# Altium schematic sheet relay_driver.SchDoc
size A2
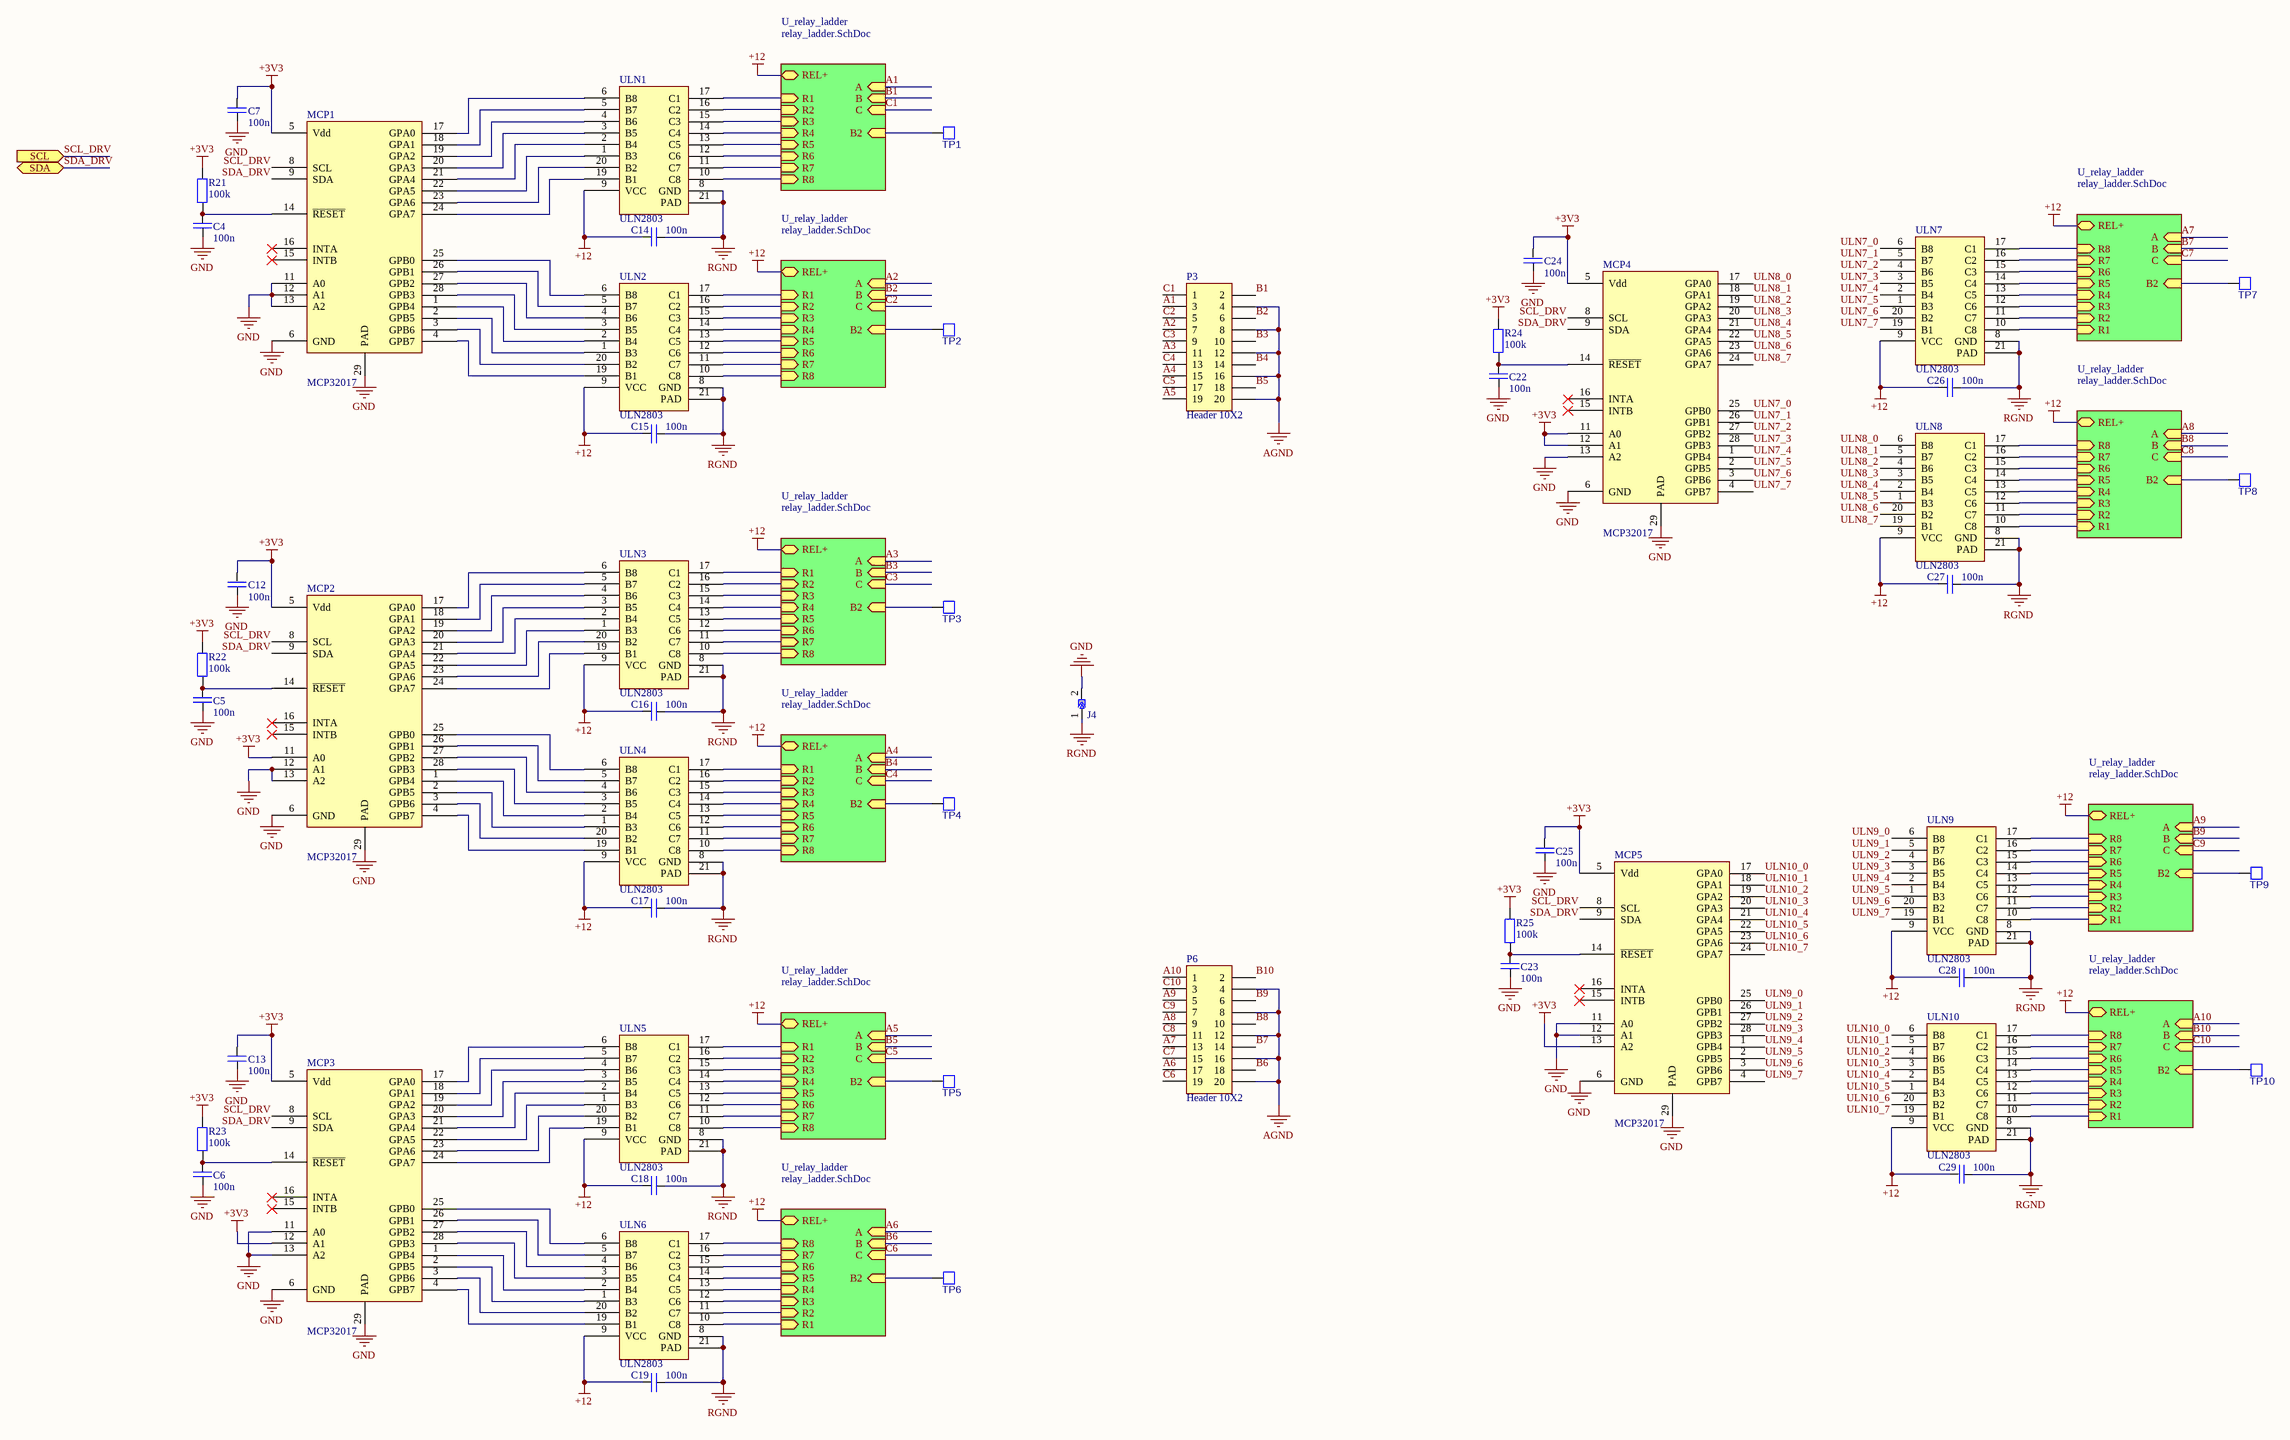
[diagram p0: relay_driver.SchDoc]

## Parts
C4  100n  [R1005_0402i_L]
C5  100n  [R1005_0402i_L]
C6  100n  [R1005_0402i_L]
C7  100n  [R1005_0402i_L]
C12  100n  [R1005_0402i_L]
C13  100n  [R1005_0402i_L]
C14  100n  [R1005_0402i_L]
C15  100n  [R1005_0402i_L]
C16  100n  [R1005_0402i_L]
C17  100n  [R1005_0402i_L]
C18  100n  [R1005_0402i_L]
C19  100n  [R1005_0402i_L]
C22  100n  [R1005_0402i_L]
C23  100n  [R1005_0402i_L]
C24  100n  [R1005_0402i_L]
C25  100n  [R1005_0402i_L]
C26  100n  [R1005_0402i_L]
C27  100n  [R1005_0402i_L]
C28  100n  [R1005_0402i_L]
C29  100n  [R1005_0402i_L]
J4  solder_jumper  [solder_jumper_triangle]  (value not drawn)
MCP1  MCP32017  [MCP23017 QFN]
MCP2  MCP32017  [MCP23017 QFN]
MCP3  MCP32017  [MCP23017 QFN]
MCP4  MCP32017  [MCP23017 QFN]
MCP5  MCP32017  [MCP23017 QFN]
P3  Header 10X2  [HDR2X10]
P6  Header 10X2  [HDR2X10]
R21  100k  [R1005_0402i_L]
R22  100k  [R1005_0402i_L]
R23  100k  [R1005_0402i_L]
R24  100k  [R1005_0402i_L]
R25  100k  [R1005_0402i_L]
TP1  PAD  [PAD_CIRC_HOLE]  (value not drawn)
TP2  PAD  [PAD_CIRC_HOLE]  (value not drawn)
TP3  PAD  [PAD_CIRC_HOLE]  (value not drawn)
TP4  PAD  [PAD_CIRC_HOLE]  (value not drawn)
TP5  PAD  [PAD_CIRC_HOLE]  (value not drawn)
TP6  PAD  [PAD_CIRC_HOLE]  (value not drawn)
TP7  PAD  [PAD_CIRC_HOLE]  (value not drawn)
TP8  PAD  [PAD_CIRC_HOLE]  (value not drawn)
TP9  PAD  [PAD_CIRC_HOLE]  (value not drawn)
TP10  PAD  [PAD_CIRC_HOLE]  (value not drawn)
ULN1  ULN2803  [QFN127P600-8N]
ULN2  ULN2803  [QFN127P600-8N]
ULN3  ULN2803  [QFN127P600-8N]
ULN4  ULN2803  [QFN127P600-8N]
ULN5  ULN2803  [QFN127P600-8N]
ULN6  ULN2803  [QFN127P600-8N]
ULN7  ULN2803  [QFN127P600-8N]
ULN8  ULN2803  [QFN127P600-8N]
ULN9  ULN2803  [QFN127P600-8N]
ULN10  ULN2803  [QFN127P600-8N]

## Sub-sheets
U_relay_ladder = relay_ladder.SchDoc: B (in), C (in), A (in), REL+ (bidir), R1 (in), R2 (in), R3 (in), R4 (in), R5 (in), R6 (in), R7 (in), R8 (in), B2 (in)
U_relay_ladder = relay_ladder.SchDoc: B (in), C (in), A (in), REL+ (bidir), R1 (in), R2 (in), R3 (in), R4 (in), R5 (in), R6 (in), R7 (in), R8 (in), B2 (in)
U_relay_ladder = relay_ladder.SchDoc: B (in), C (in), A (in), REL+ (bidir), R1 (in), R2 (in), R3 (in), R4 (in), R5 (in), R6 (in), R7 (in), R8 (in), B2 (in)
U_relay_ladder = relay_ladder.SchDoc: B (in), C (in), A (in), REL+ (bidir), R1 (in), R2 (in), R3 (in), R4 (in), R5 (in), R6 (in), R7 (in), R8 (in), B2 (in)
U_relay_ladder = relay_ladder.SchDoc: B (in), C (in), A (in), REL+ (bidir), R1 (in), R2 (in), R3 (in), R4 (in), R5 (in), R6 (in), R7 (in), R8 (in), B2 (in)
U_relay_ladder = relay_ladder.SchDoc: B (in), C (in), A (in), REL+ (bidir), R1 (in), R2 (in), R3 (in), R4 (in), R5 (in), R6 (in), R7 (in), R8 (in), B2 (in)
U_relay_ladder = relay_ladder.SchDoc: B (in), C (in), A (in), REL+ (bidir), R1 (in), R2 (in), R3 (in), R4 (in), R5 (in), R6 (in), R7 (in), R8 (in), B2 (in)
U_relay_ladder = relay_ladder.SchDoc: B (in), C (in), A (in), REL+ (bidir), R1 (in), R2 (in), R3 (in), R4 (in), R5 (in), R6 (in), R7 (in), R8 (in), B2 (in)
U_relay_ladder = relay_ladder.SchDoc: B (in), C (in), A (in), REL+ (bidir), R1 (in), R2 (in), R3 (in), R4 (in), R5 (in), R6 (in), R7 (in), R8 (in), B2 (in)
U_relay_ladder = relay_ladder.SchDoc: B (in), C (in), A (in), REL+ (bidir), R1 (in), R2 (in), R3 (in), R4 (in), R5 (in), R6 (in), R7 (in), R8 (in), B2 (in)

## Ports
SCL (in), SDA (bidir)

## Nets
+3V3: C7.2 C12.2 C13.2 C24.2 C25.2 MCP1.5(Vdd) MCP2.5(Vdd) MCP2.11(A0) MCP3.5(Vdd) MCP3.12(A1) MCP4.5(Vdd) MCP4.11(A0) MCP4.12(A1) MCP5.5(Vdd) MCP5.13(A2) R21.1 R22.1 R23.1 R24.1 R25.1
+12: C14.1 C15.1 C16.1 C17.1 C18.1 C19.1 C26.1 C27.1 C28.1 C29.1 ULN1.9(VCC) ULN2.9(VCC) ULN3.9(VCC) ULN4.9(VCC) ULN5.9(VCC) ULN6.9(VCC) ULN7.9(VCC) ULN8.9(VCC) ULN9.9(VCC) ULN10.9(VCC) ; sheet U_relay_ladder/REL+, sheet U_relay_ladder/REL+, sheet U_relay_ladder/REL+, sheet U_relay_ladder/REL+, sheet U_relay_ladder/REL+, sheet U_relay_ladder/REL+, sheet U_relay_ladder/REL+, sheet U_relay_ladder/REL+, sheet U_relay_ladder/REL+, sheet U_relay_ladder/REL+
AGND: P3.4 P3.8 P3.12 P3.16 P3.20 P6.4 P6.8 P6.12 P6.16 P6.20
GND: C4.1 C5.1 C6.1 C7.1 C12.1 C13.1 C22.1 C23.1 C24.1 C25.1 J4.2 MCP1.6(GND) MCP1.11(A0) MCP1.12(A1) MCP1.13(A2) MCP1.29(PAD) MCP2.6(GND) MCP2.12(A1) MCP2.13(A2) MCP2.29(PAD) MCP3.6(GND) MCP3.11(A0) MCP3.13(A2) MCP3.29(PAD) MCP4.6(GND) MCP4.13(A2) MCP4.29(PAD) MCP5.6(GND) MCP5.11(A0) MCP5.12(A1) MCP5.29(PAD)
RGND: C14.2 C15.2 C16.2 C17.2 C18.2 C19.2 C26.2 C27.2 C28.2 C29.2 J4.1 ULN1.8(GND) ULN1.21(PAD) ULN2.8(GND) ULN2.21(PAD) ULN3.8(GND) ULN3.21(PAD) ULN4.8(GND) ULN4.21(PAD) ULN5.8(GND) ULN5.21(PAD) ULN6.8(GND) ULN6.21(PAD) ULN7.8(GND) ULN7.21(PAD) ULN8.8(GND) ULN8.21(PAD) ULN9.8(GND) ULN9.21(PAD) ULN10.8(GND) ULN10.21(PAD)
A1: P3.3 ; sheet U_relay_ladder/A
A2: P3.7 ; sheet U_relay_ladder/A
A3: P3.11 ; sheet U_relay_ladder/A
A4: P3.15 ; sheet U_relay_ladder/A
A5: P3.19 ; sheet U_relay_ladder/A
A6: P6.17 ; sheet U_relay_ladder/A
A7: P6.13 ; sheet U_relay_ladder/A
A8: P6.9 ; sheet U_relay_ladder/A
A9: P6.5 ; sheet U_relay_ladder/A
A10: P6.1 ; sheet U_relay_ladder/A
B1: P3.2 ; sheet U_relay_ladder/B
B2: P3.6 ; sheet U_relay_ladder/B
B3: P3.10 ; sheet U_relay_ladder/B
B4: P3.14 ; sheet U_relay_ladder/B
B5: P3.18 ; sheet U_relay_ladder/B
B6: P6.18 ; sheet U_relay_ladder/B
B7: P6.14 ; sheet U_relay_ladder/B
B8: P6.10 ; sheet U_relay_ladder/B
B9: P6.6 ; sheet U_relay_ladder/B
B10: P6.2 ; sheet U_relay_ladder/B
C1: P3.1 ; sheet U_relay_ladder/C
C2: P3.5 ; sheet U_relay_ladder/C
C3: P3.9 ; sheet U_relay_ladder/C
C4: P3.13 ; sheet U_relay_ladder/C
C5: P3.17 ; sheet U_relay_ladder/C
C6: P6.19 ; sheet U_relay_ladder/C
C7: P6.15 ; sheet U_relay_ladder/C
C8: P6.11 ; sheet U_relay_ladder/C
C9: P6.7 ; sheet U_relay_ladder/C
C10: P6.3 ; sheet U_relay_ladder/C
SCL_DRV: MCP1.8(SCL) MCP2.8(SCL) MCP3.8(SCL) MCP4.8(SCL) MCP5.8(SCL) ; port SCL
SDA_DRV: MCP1.9(SDA) MCP2.9(SDA) MCP3.9(SDA) MCP4.9(SDA) MCP5.9(SDA) ; port SDA
ULN7_0: MCP4.25(GPB0) ULN7.6(B8)
ULN7_1: MCP4.26(GPB1) ULN7.5(B7)
ULN7_2: MCP4.27(GPB2) ULN7.4(B6)
ULN7_3: MCP4.28(GPB3) ULN7.3(B5)
ULN7_4: MCP4.1(GPB4) ULN7.2(B4)
ULN7_5: MCP4.2(GPB5) ULN7.1(B3)
ULN7_6: MCP4.3(GPB6) ULN7.20(B2)
ULN7_7: MCP4.4(GPB7) ULN7.19(B1)
ULN8_0: MCP4.17(GPA0) ULN8.6(B8)
ULN8_1: MCP4.18(GPA1) ULN8.5(B7)
ULN8_2: MCP4.19(GPA2) ULN8.4(B6)
ULN8_3: MCP4.20(GPA3) ULN8.3(B5)
ULN8_4: MCP4.21(GPA4) ULN8.2(B4)
ULN8_5: MCP4.22(GPA5) ULN8.1(B3)
ULN8_6: MCP4.23(GPA6) ULN8.20(B2)
ULN8_7: MCP4.24(GPA7) ULN8.19(B1)
ULN9_0: MCP5.25(GPB0) ULN9.6(B8)
ULN9_1: MCP5.26(GPB1) ULN9.5(B7)
ULN9_2: MCP5.27(GPB2) ULN9.4(B6)
ULN9_3: MCP5.28(GPB3) ULN9.3(B5)
ULN9_4: MCP5.1(GPB4) ULN9.2(B4)
ULN9_5: MCP5.2(GPB5) ULN9.1(B3)
ULN9_6: MCP5.3(GPB6) ULN9.20(B2)
ULN9_7: MCP5.4(GPB7) ULN9.19(B1)
ULN10_0: MCP5.17(GPA0) ULN10.6(B8)
ULN10_1: MCP5.18(GPA1) ULN10.5(B7)
ULN10_2: MCP5.19(GPA2) ULN10.4(B6)
ULN10_3: MCP5.20(GPA3) ULN10.3(B5)
ULN10_4: MCP5.21(GPA4) ULN10.2(B4)
ULN10_5: MCP5.22(GPA5) ULN10.1(B3)
ULN10_6: MCP5.23(GPA6) ULN10.20(B2)
ULN10_7: MCP5.24(GPA7) ULN10.19(B1)
NetC4_2: C4.2 MCP1.14(~{RESET}) R21.2
NetC5_2: C5.2 MCP2.14(~{RESET}) R22.2
NetC6_2: C6.2 MCP3.14(~{RESET}) R23.2
NetC22_2: C22.2 MCP4.14(~{RESET}) R24.2
NetC23_2: C23.2 MCP5.14(~{RESET}) R25.2
NetMCP1_1: MCP1.1(GPB4) ULN2.2(B4)
NetMCP1_2: MCP1.2(GPB5) ULN2.1(B3)
NetMCP1_3: MCP1.3(GPB6) ULN2.20(B2)
NetMCP1_4: MCP1.4(GPB7) ULN2.19(B1)
NetMCP1_17: MCP1.17(GPA0) ULN1.6(B8)
NetMCP1_18: MCP1.18(GPA1) ULN1.5(B7)
NetMCP1_19: MCP1.19(GPA2) ULN1.4(B6)
NetMCP1_20: MCP1.20(GPA3) ULN1.3(B5)
NetMCP1_21: MCP1.21(GPA4) ULN1.2(B4)
NetMCP1_22: MCP1.22(GPA5) ULN1.1(B3)
NetMCP1_23: MCP1.23(GPA6) ULN1.20(B2)
NetMCP1_24: MCP1.24(GPA7) ULN1.19(B1)
NetMCP1_25: MCP1.25(GPB0) ULN2.6(B8)
NetMCP1_26: MCP1.26(GPB1) ULN2.5(B7)
NetMCP1_27: MCP1.27(GPB2) ULN2.4(B6)
NetMCP1_28: MCP1.28(GPB3) ULN2.3(B5)
NetMCP2_1: MCP2.1(GPB4) ULN4.2(B4)
NetMCP2_2: MCP2.2(GPB5) ULN4.1(B3)
NetMCP2_3: MCP2.3(GPB6) ULN4.20(B2)
NetMCP2_4: MCP2.4(GPB7) ULN4.19(B1)
NetMCP2_17: MCP2.17(GPA0) ULN3.6(B8)
NetMCP2_18: MCP2.18(GPA1) ULN3.5(B7)
NetMCP2_19: MCP2.19(GPA2) ULN3.4(B6)
NetMCP2_20: MCP2.20(GPA3) ULN3.3(B5)
NetMCP2_21: MCP2.21(GPA4) ULN3.2(B4)
NetMCP2_22: MCP2.22(GPA5) ULN3.1(B3)
NetMCP2_23: MCP2.23(GPA6) ULN3.20(B2)
NetMCP2_24: MCP2.24(GPA7) ULN3.19(B1)
NetMCP2_25: MCP2.25(GPB0) ULN4.6(B8)
NetMCP2_26: MCP2.26(GPB1) ULN4.5(B7)
NetMCP2_27: MCP2.27(GPB2) ULN4.4(B6)
NetMCP2_28: MCP2.28(GPB3) ULN4.3(B5)
NetMCP3_1: MCP3.1(GPB4) ULN6.2(B4)
NetMCP3_2: MCP3.2(GPB5) ULN6.1(B3)
NetMCP3_3: MCP3.3(GPB6) ULN6.20(B2)
NetMCP3_4: MCP3.4(GPB7) ULN6.19(B1)
NetMCP3_17: MCP3.17(GPA0) ULN5.6(B8)
NetMCP3_18: MCP3.18(GPA1) ULN5.5(B7)
NetMCP3_19: MCP3.19(GPA2) ULN5.4(B6)
NetMCP3_20: MCP3.20(GPA3) ULN5.3(B5)
NetMCP3_21: MCP3.21(GPA4) ULN5.2(B4)
NetMCP3_22: MCP3.22(GPA5) ULN5.1(B3)
NetMCP3_23: MCP3.23(GPA6) ULN5.20(B2)
NetMCP3_24: MCP3.24(GPA7) ULN5.19(B1)
NetMCP3_25: MCP3.25(GPB0) ULN6.6(B8)
NetMCP3_26: MCP3.26(GPB1) ULN6.5(B7)
NetMCP3_27: MCP3.27(GPB2) ULN6.4(B6)
NetMCP3_28: MCP3.28(GPB3) ULN6.3(B5)
NetTP1_1: TP1.1 ; sheet U_relay_ladder/B2
NetTP2_1: TP2.1 ; sheet U_relay_ladder/B2
NetTP3_1: TP3.1 ; sheet U_relay_ladder/B2
NetTP4_1: TP4.1 ; sheet U_relay_ladder/B2
NetTP5_1: TP5.1 ; sheet U_relay_ladder/B2
NetTP6_1: TP6.1 ; sheet U_relay_ladder/B2
NetTP7_1: TP7.1 ; sheet U_relay_ladder/B2
NetTP8_1: TP8.1 ; sheet U_relay_ladder/B2
NetTP9_1: TP9.1 ; sheet U_relay_ladder/B2
NetTP10_1: TP10.1 ; sheet U_relay_ladder/B2
NetULN1_10: ULN1.10(C8) ; sheet U_relay_ladder/R8
NetULN1_11: ULN1.11(C7) ; sheet U_relay_ladder/R7
NetULN1_12: ULN1.12(C6) ; sheet U_relay_ladder/R6
NetULN1_13: ULN1.13(C5) ; sheet U_relay_ladder/R5
NetULN1_14: ULN1.14(C4) ; sheet U_relay_ladder/R4
NetULN1_15: ULN1.15(C3) ; sheet U_relay_ladder/R3
NetULN1_16: ULN1.16(C2) ; sheet U_relay_ladder/R2
NetULN1_17: ULN1.17(C1) ; sheet U_relay_ladder/R1
NetULN2_10: ULN2.10(C8) ; sheet U_relay_ladder/R8
NetULN2_11: ULN2.11(C7) ; sheet U_relay_ladder/R7
NetULN2_12: ULN2.12(C6) ; sheet U_relay_ladder/R6
NetULN2_13: ULN2.13(C5) ; sheet U_relay_ladder/R5
NetULN2_14: ULN2.14(C4) ; sheet U_relay_ladder/R4
NetULN2_15: ULN2.15(C3) ; sheet U_relay_ladder/R3
NetULN2_16: ULN2.16(C2) ; sheet U_relay_ladder/R2
NetULN2_17: ULN2.17(C1) ; sheet U_relay_ladder/R1
NetULN3_10: ULN3.10(C8) ; sheet U_relay_ladder/R8
NetULN3_11: ULN3.11(C7) ; sheet U_relay_ladder/R7
NetULN3_12: ULN3.12(C6) ; sheet U_relay_ladder/R6
NetULN3_13: ULN3.13(C5) ; sheet U_relay_ladder/R5
NetULN3_14: ULN3.14(C4) ; sheet U_relay_ladder/R4
NetULN3_15: ULN3.15(C3) ; sheet U_relay_ladder/R3
NetULN3_16: ULN3.16(C2) ; sheet U_relay_ladder/R2
NetULN3_17: ULN3.17(C1) ; sheet U_relay_ladder/R1
NetULN4_10: ULN4.10(C8) ; sheet U_relay_ladder/R8
NetULN4_11: ULN4.11(C7) ; sheet U_relay_ladder/R7
NetULN4_12: ULN4.12(C6) ; sheet U_relay_ladder/R6
NetULN4_13: ULN4.13(C5) ; sheet U_relay_ladder/R5
NetULN4_14: ULN4.14(C4) ; sheet U_relay_ladder/R4
NetULN4_15: ULN4.15(C3) ; sheet U_relay_ladder/R3
NetULN4_16: ULN4.16(C2) ; sheet U_relay_ladder/R2
NetULN4_17: ULN4.17(C1) ; sheet U_relay_ladder/R1
NetULN5_10: ULN5.10(C8) ; sheet U_relay_ladder/R8
NetULN5_11: ULN5.11(C7) ; sheet U_relay_ladder/R7
NetULN5_12: ULN5.12(C6) ; sheet U_relay_ladder/R6
NetULN5_13: ULN5.13(C5) ; sheet U_relay_ladder/R5
NetULN5_14: ULN5.14(C4) ; sheet U_relay_ladder/R4
NetULN5_15: ULN5.15(C3) ; sheet U_relay_ladder/R3
NetULN5_16: ULN5.16(C2) ; sheet U_relay_ladder/R2
NetULN5_17: ULN5.17(C1) ; sheet U_relay_ladder/R1
NetULN6_10: ULN6.10(C8) ; sheet U_relay_ladder/R1
NetULN6_11: ULN6.11(C7) ; sheet U_relay_ladder/R2
NetULN6_12: ULN6.12(C6) ; sheet U_relay_ladder/R3
NetULN6_13: ULN6.13(C5) ; sheet U_relay_ladder/R4
NetULN6_14: ULN6.14(C4) ; sheet U_relay_ladder/R5
NetULN6_15: ULN6.15(C3) ; sheet U_relay_ladder/R6
NetULN6_16: ULN6.16(C2) ; sheet U_relay_ladder/R7
NetULN6_17: ULN6.17(C1) ; sheet U_relay_ladder/R8
NetULN7_10: ULN7.10(C8) ; sheet U_relay_ladder/R1
NetULN7_11: ULN7.11(C7) ; sheet U_relay_ladder/R2
NetULN7_12: ULN7.12(C6) ; sheet U_relay_ladder/R3
NetULN7_13: ULN7.13(C5) ; sheet U_relay_ladder/R4
NetULN7_14: ULN7.14(C4) ; sheet U_relay_ladder/R5
NetULN7_15: ULN7.15(C3) ; sheet U_relay_ladder/R6
NetULN7_16: ULN7.16(C2) ; sheet U_relay_ladder/R7
NetULN7_17: ULN7.17(C1) ; sheet U_relay_ladder/R8
NetULN8_10: ULN8.10(C8) ; sheet U_relay_ladder/R1
NetULN8_11: ULN8.11(C7) ; sheet U_relay_ladder/R2
NetULN8_12: ULN8.12(C6) ; sheet U_relay_ladder/R3
NetULN8_13: ULN8.13(C5) ; sheet U_relay_ladder/R4
NetULN8_14: ULN8.14(C4) ; sheet U_relay_ladder/R5
NetULN8_15: ULN8.15(C3) ; sheet U_relay_ladder/R6
NetULN8_16: ULN8.16(C2) ; sheet U_relay_ladder/R7
NetULN8_17: ULN8.17(C1) ; sheet U_relay_ladder/R8
NetULN9_10: ULN9.10(C8) ; sheet U_relay_ladder/R1
NetULN9_11: ULN9.11(C7) ; sheet U_relay_ladder/R2
NetULN9_12: ULN9.12(C6) ; sheet U_relay_ladder/R3
NetULN9_13: ULN9.13(C5) ; sheet U_relay_ladder/R4
NetULN9_14: ULN9.14(C4) ; sheet U_relay_ladder/R5
NetULN9_15: ULN9.15(C3) ; sheet U_relay_ladder/R6
NetULN9_16: ULN9.16(C2) ; sheet U_relay_ladder/R7
NetULN9_17: ULN9.17(C1) ; sheet U_relay_ladder/R8
NetULN10_10: ULN10.10(C8) ; sheet U_relay_ladder/R1
NetULN10_11: ULN10.11(C7) ; sheet U_relay_ladder/R2
NetULN10_12: ULN10.12(C6) ; sheet U_relay_ladder/R3
NetULN10_13: ULN10.13(C5) ; sheet U_relay_ladder/R4
NetULN10_14: ULN10.14(C4) ; sheet U_relay_ladder/R5
NetULN10_15: ULN10.15(C3) ; sheet U_relay_ladder/R6
NetULN10_16: ULN10.16(C2) ; sheet U_relay_ladder/R7
NetULN10_17: ULN10.17(C1) ; sheet U_relay_ladder/R8

Not connected (* = marked no-connect by the designer): MCP1 15(INTB)* 16(INTA)*; MCP2 15(INTB)* 16(INTA)*; MCP3 15(INTB)* 16(INTA)*; MCP4 15(INTB)* 16(INTA)*; MCP5 15(INTB)* 16(INTA)*

## Library data of the parts
C4-C7 C12-C19 C22-C29 = C: Capacitor
P3 P6 = Header 10X2: Header, 10-Pin, Dual row; LatestRevisionDate: 17-Jul-2002; LatestRevisionNote: Re-released for DXP Platform.; Publisher: Altium Limited
R21-R25 = R